# Altium project Electro_plant.PrjPcb
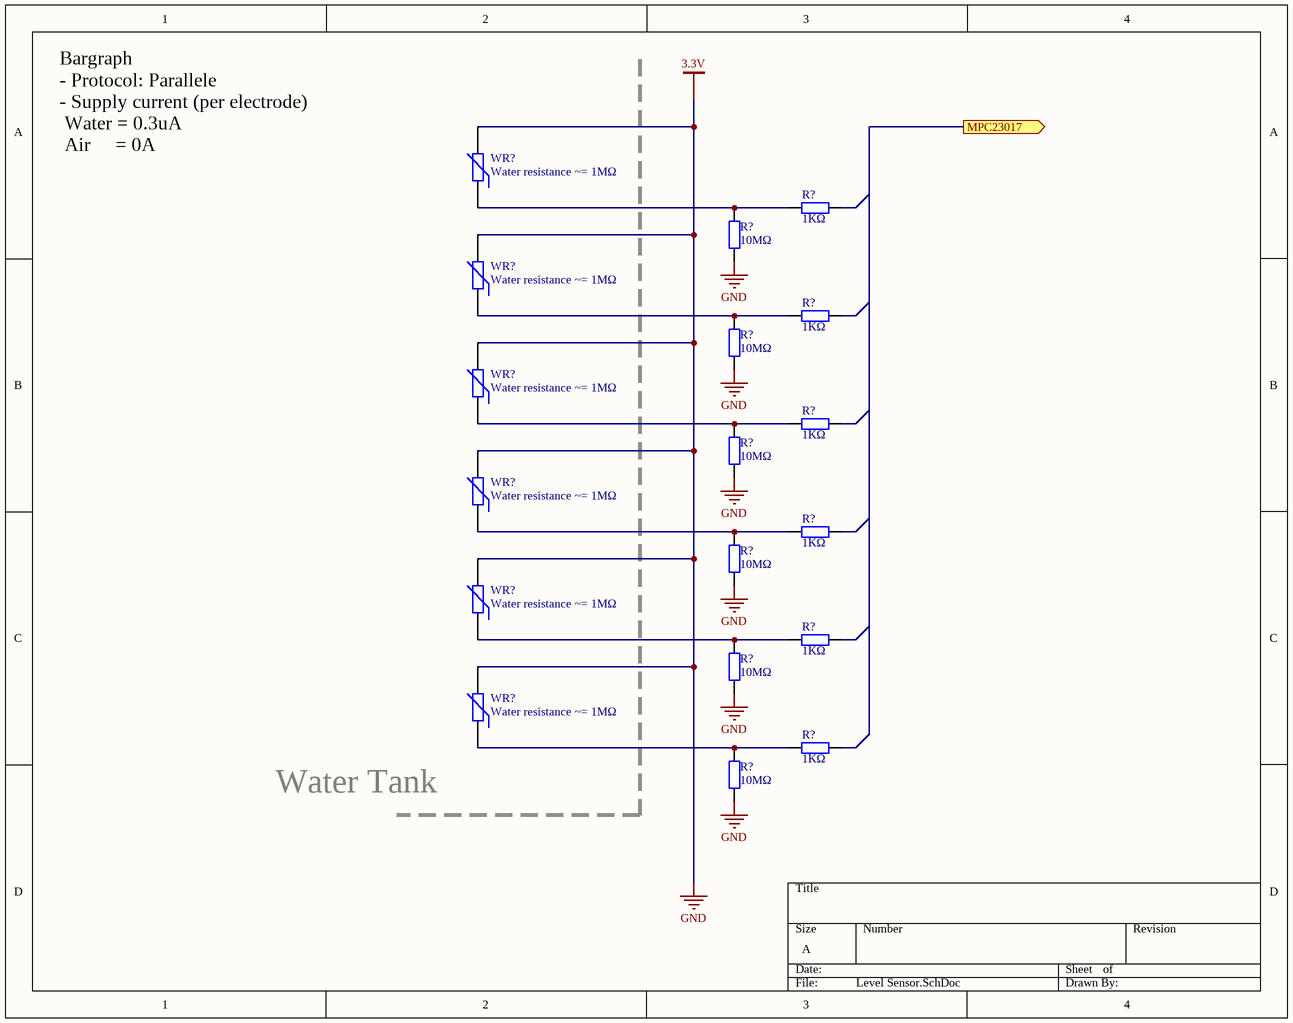
[diagram p0: Level Sensor.SchDoc]
10 sheets, 61 parts. Net scope: flat (ports and power ports of the same name join across sheets).
Sheets:
  Level Sensor.SchDoc
  BarGraph.SchDoc
  LCD.SchDoc
  LumSensor.SchDoc
  MPC23017.SchDoc
  Temperature.SchDoc
  SoilMoisture.SchDoc
  PIC.SchDoc
  LedAlert.SchDoc
  BlueTooth.SchDoc

## Sheet Level Sensor.SchDoc
size A

### Parts
(Parts that share a designator on the sheet are numbered #1, #2 ... from top to bottom, then left to right.)
R?#1  1KΩ  [AXIAL-0.4]
R?#2  10MΩ  [AXIAL-0.4]
R?#3  1KΩ  [AXIAL-0.4]
R?#4  10MΩ  [AXIAL-0.4]
R?#5  1KΩ  [AXIAL-0.4]
R?#6  10MΩ  [AXIAL-0.4]
R?#7  1KΩ  [AXIAL-0.4]
R?#8  10MΩ  [AXIAL-0.4]
R?#9  1KΩ  [AXIAL-0.4]
R?#10  10MΩ  [AXIAL-0.4]
R?#11  1KΩ  [AXIAL-0.4]
R?#12  10MΩ  [AXIAL-0.4]
WR?#1  Water resistance ~= 1MΩ  [6-0805_N]
WR?#2  Water resistance ~= 1MΩ  [6-0805_N]
WR?#3  Water resistance ~= 1MΩ  [6-0805_N]
WR?#4  Water resistance ~= 1MΩ  [6-0805_N]
WR?#5  Water resistance ~= 1MΩ  [6-0805_N]
WR?#6  Water resistance ~= 1MΩ  [6-0805_N]

### Ports
MPC23017 (out)

### Nets
3.3V: R?#2.1 R?#4.1 R?#6.1 R?#8.1 R?#10.1 R?#12.1 WR?#1.2 WR?#2.2 WR?#3.2 WR?#4.2 WR?#5.2 WR?#6.2  [also labelled GND]
NetR?#1_2: R?#1.2 R?#2.2 WR?#1.1
NetR?#3_2: R?#3.2 R?#4.2 WR?#2.1
NetR?#5_2: R?#5.2 R?#6.2 WR?#3.1
NetR?#7_2: R?#7.2 R?#8.2 WR?#4.1
NetR?#9_2: R?#9.2 R?#10.2 WR?#5.1
NetR?#11_2: R?#11.2 R?#12.2 WR?#6.1

Not connected (* = marked no-connect by the designer): R?#1 1; R?#3 1; R?#5 1; R?#7 1; R?#9 1; R?#11 1

### Notes on the sheet
- Bargraph
  - Protocol: Parallele
  - Supply current (per electrode)
  Water = 0.3uA
  Air     = 0A
- Water Tank

### Library data of the parts
R?#1-R?#12 = Res2: Resistor; Value: 1K; Published: 8-Jun-2000; LatestRevisionDate: 17-Jul-2002; LatestRevisionNote: Re-released for DXP Platform.; PackageReference: AXIAL-0.4; Publisher: Altium Limited; PackageDescription: Axial Device, Thru-Hole; 2 Leads; 0.4 in Pin Spacing
WR?#1-WR?#6 = Res Varistor: Varistor (Voltage-Sensitive Resistor); Published: 24-Mar-1999; LatestRevisionDate: 29-May-2009; LatestRevisionNote: IPC-7351 Footprint Added.; PackageVersion: Mar-2003; PackageReference: 6-0805; Publisher: Altium Limited; PackageDescription: Chip Resistor 0805 Case Size; Code_IPC: RESC2012

## Sheet BarGraph.SchDoc
size A
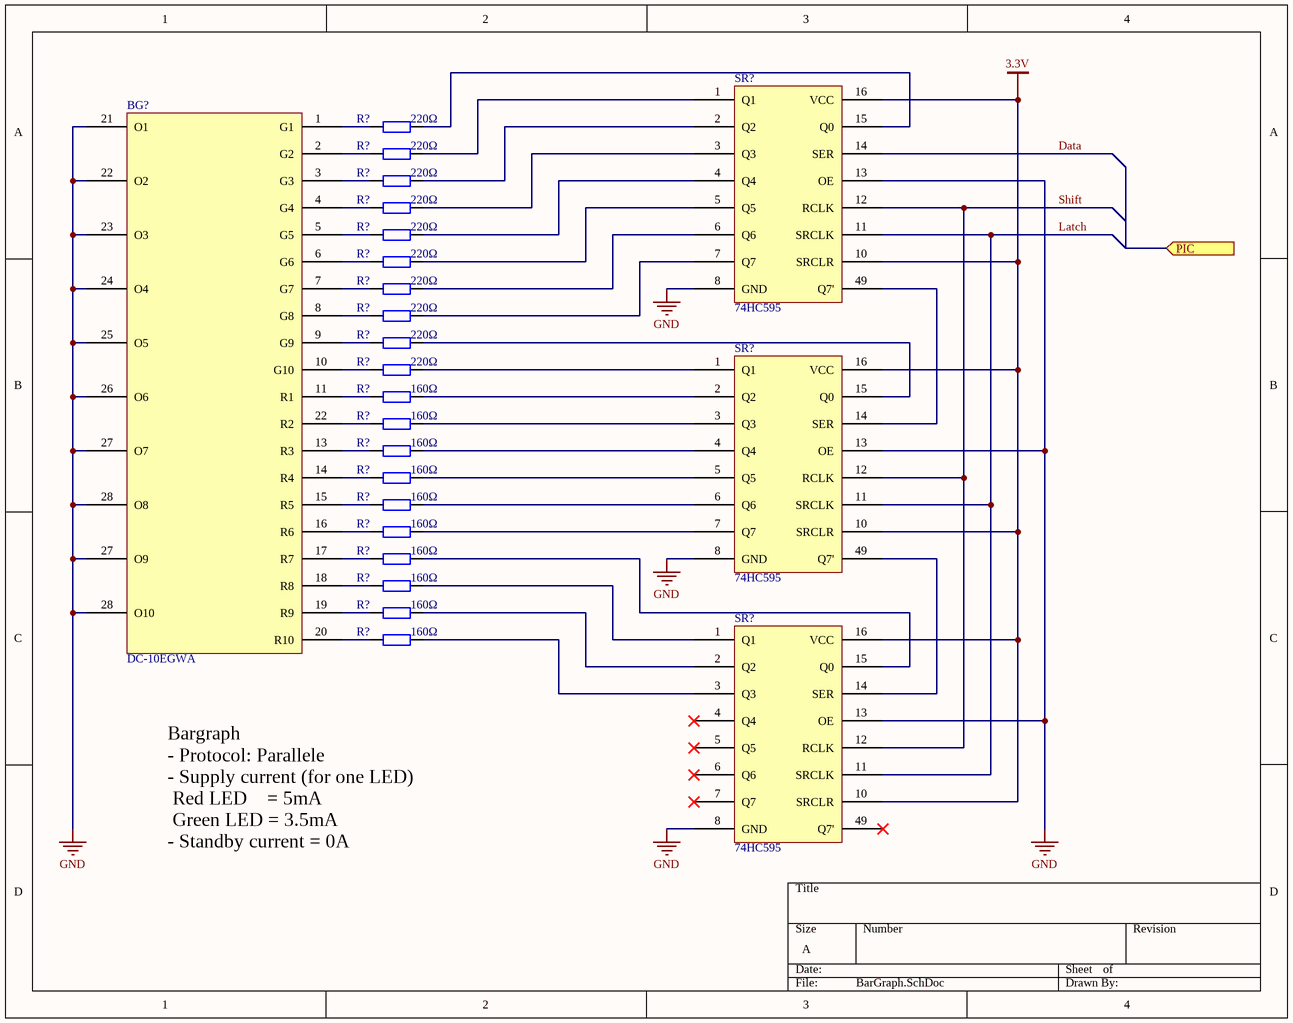
[diagram p1: BarGraph.SchDoc]

### Parts
(Parts that share a designator on the sheet are numbered #1, #2 ... from top to bottom, then left to right.)
BG?  DC-10EGWA
R?#13  220Ω  [AXIAL-0.4]
R?#14  220Ω  [AXIAL-0.4]
R?#15  220Ω  [AXIAL-0.4]
R?#16  220Ω  [AXIAL-0.4]
R?#17  220Ω  [AXIAL-0.4]
R?#18  220Ω  [AXIAL-0.4]
R?#19  220Ω  [AXIAL-0.4]
R?#20  220Ω  [AXIAL-0.4]
R?#21  220Ω  [AXIAL-0.4]
R?#22  220Ω  [AXIAL-0.4]
R?#23  160Ω  [AXIAL-0.4]
R?#24  160Ω  [AXIAL-0.4]
R?#25  160Ω  [AXIAL-0.4]
R?#26  160Ω  [AXIAL-0.4]
R?#27  160Ω  [AXIAL-0.4]
R?#28  160Ω  [AXIAL-0.4]
R?#29  160Ω  [AXIAL-0.4]
R?#30  160Ω  [AXIAL-0.4]
R?#31  160Ω  [AXIAL-0.4]
R?#32  160Ω  [AXIAL-0.4]
SR?#1  74HC595
SR?#2  74HC595
SR?#3  74HC595

### Ports
PIC (in)

### Nets
3.3V: BG?.21(O1) BG?.22(O2) BG?.23(O3) BG?.24(O4) BG?.25(O5) BG?.26(O6) BG?.27(O7) BG?.28(O8) SR?#1.8(GND) SR?#1.10(SRCLR) SR?#1.13(OE) SR?#1.16(VCC) SR?#2.8(GND) SR?#2.10(SRCLR) SR?#2.13(OE) SR?#2.16(VCC) SR?#3.8(GND) SR?#3.10(SRCLR) SR?#3.13(OE) SR?#3.16(VCC)  [also labelled GND]
Data: SR?#1.14(SER)
Latch: SR?#1.11(SRCLK) SR?#2.11(SRCLK) SR?#3.11(SRCLK)
Shift: SR?#1.12(RCLK) SR?#2.12(RCLK) SR?#3.12(RCLK)
NetBG?_1: BG?.1(G1) R?#13.1
NetBG?_2: BG?.2(G2) R?#14.1
NetBG?_3: BG?.3(G3) R?#15.1
NetBG?_4: BG?.4(G4) R?#16.1
NetBG?_5: BG?.5(G5) R?#17.1
NetBG?_6: BG?.6(G6) R?#18.1
NetBG?_7: BG?.7(G7) R?#19.1
NetBG?_8: BG?.8(G8) R?#20.1
NetBG?_9: BG?.9(G9) R?#21.1
NetBG?_10: BG?.10(G10) R?#22.1
NetBG?_11: BG?.11(R1) R?#23.1
NetBG?_13: BG?.13(R3) R?#25.1
NetBG?_14: BG?.14(R4) R?#26.1
NetBG?_15: BG?.15(R5) R?#27.1
NetBG?_16: BG?.16(R6) R?#28.1
NetBG?_17: BG?.17(R7) R?#29.1
NetBG?_18: BG?.18(R8) R?#30.1
NetBG?_19: BG?.19(R9) R?#31.1
NetBG?_20: BG?.20(R10) R?#32.1
NetBG?_22: BG?.22(R2) R?#24.1
NetR?#13_2: R?#13.2 SR?#1.15(Q0)
NetR?#14_2: R?#14.2 SR?#1.1(Q1)
NetR?#15_2: R?#15.2 SR?#1.2(Q2)
NetR?#16_2: R?#16.2 SR?#1.3(Q3)
NetR?#17_2: R?#17.2 SR?#1.4(Q4)
NetR?#18_2: R?#18.2 SR?#1.5(Q5)
NetR?#19_2: R?#19.2 SR?#1.6(Q6)
NetR?#20_2: R?#20.2 SR?#1.7(Q7)
NetR?#21_2: R?#21.2 SR?#2.15(Q0)
NetR?#22_2: R?#22.2 SR?#2.1(Q1)
NetR?#23_2: R?#23.2 SR?#2.2(Q2)
NetR?#24_2: R?#24.2 SR?#2.3(Q3)
NetR?#25_2: R?#25.2 SR?#2.4(Q4)
NetR?#26_2: R?#26.2 SR?#2.5(Q5)
NetR?#27_2: R?#27.2 SR?#2.6(Q6)
NetR?#28_2: R?#28.2 SR?#2.7(Q7)
NetR?#29_2: R?#29.2 SR?#3.15(Q0)
NetR?#30_2: R?#30.2 SR?#3.1(Q1)
NetR?#31_2: R?#31.2 SR?#3.2(Q2)
NetR?#32_2: R?#32.2 SR?#3.3(Q3)
NetSR?#1_49: SR?#1.49(Q7') SR?#2.14(SER)
NetSR?#2_49: SR?#2.49(Q7') SR?#3.14(SER)

Not connected (* = marked no-connect by the designer): SR?#3 4(Q4)* 5(Q5)* 6(Q6)* 7(Q7)* 49(Q7')*

### Notes on the sheet
- Bargraph
  - Protocol: Parallele
  - Supply current (for one LED)
  Red LED    = 5mA
  Green LED = 3.5mA
  - Standby current = 0A

### Library data of the parts
BG? SR?#1-SR?#3 = Component_1
R?#13-R?#32 = Res2: Resistor; Value: 1K; Published: 8-Jun-2000; LatestRevisionDate: 17-Jul-2002; LatestRevisionNote: Re-released for DXP Platform.; PackageReference: AXIAL-0.4; Publisher: Altium Limited; PackageDescription: Axial Device, Thru-Hole; 2 Leads; 0.4 in Pin Spacing

## Sheet LCD.SchDoc
size A
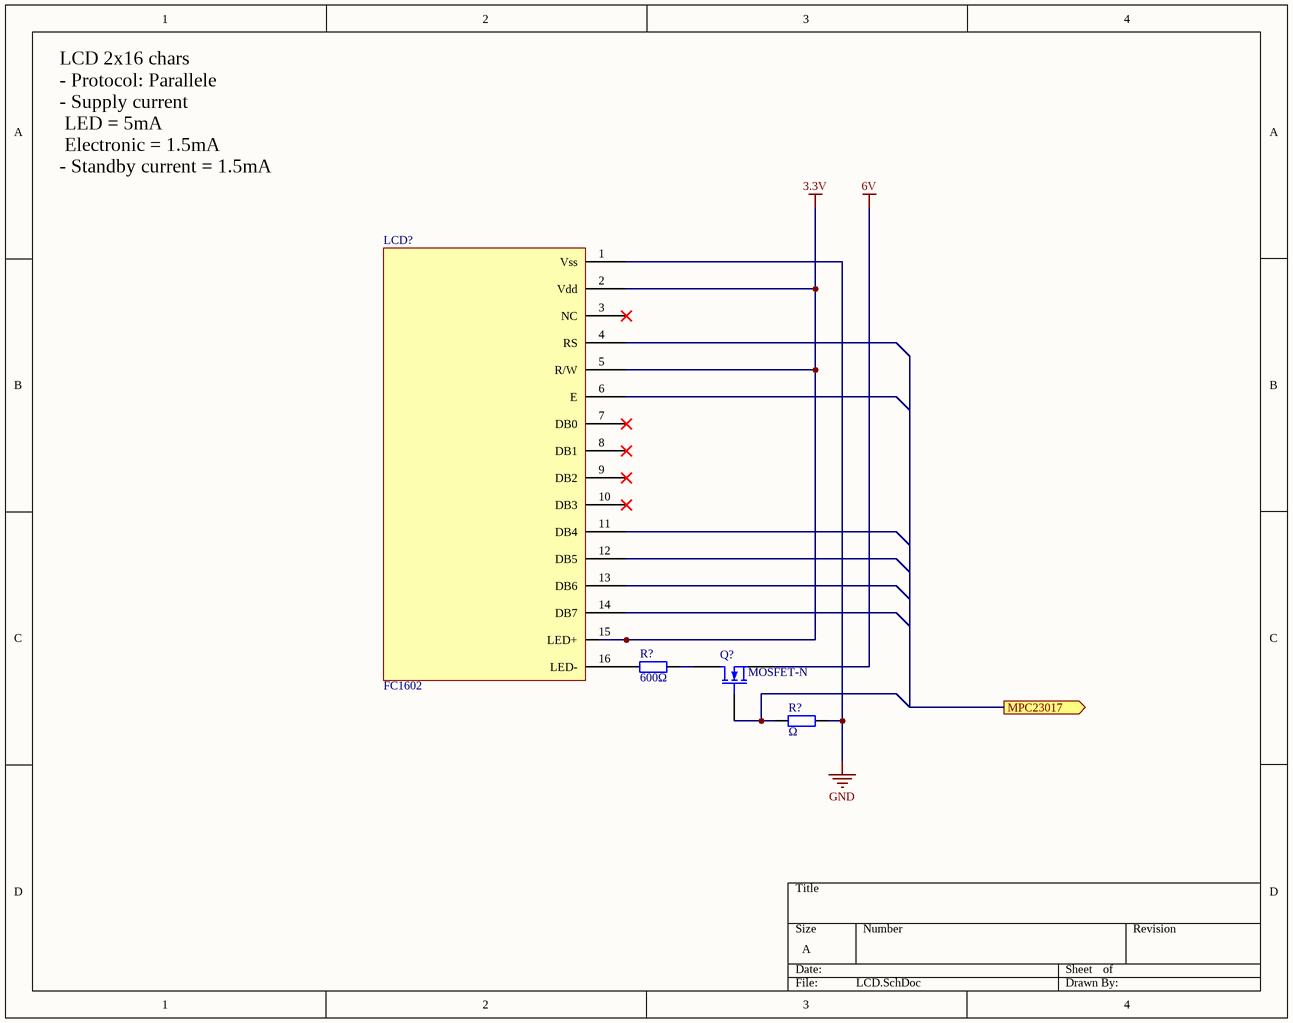
[diagram p2: LCD.SchDoc]

### Parts
(Parts that share a designator on the sheet are numbered #1, #2 ... from top to bottom, then left to right.)
LCD?  FC1602
Q?#1  MOSFET-N  [E3]
R?#33  600Ω  [AXIAL-0.4]
R?#34  Ω  [AXIAL-0.4]

### Ports
MPC23017 (out)

### Nets
3.3V: LCD?.1(Vss) LCD?.2(Vdd) LCD?.5(R/W) LCD?.15(LED+) R?#34.1  [also labelled GND]
6V: Q?#1.3(S)
NetLCD?_16: LCD?.16(LED-) R?#33.2
NetQ?#1_1: Q?#1.1(D) R?#33.1
NetQ?#1_2: Q?#1.2(G) R?#34.2

Not connected (* = marked no-connect by the designer): LCD? 3(NC)* 4(RS) 6(E) 7(DB0)* 8(DB1)* 9(DB2)* 10(DB3)* 11(DB4) 12(DB5) 13(DB6) 14(DB7)

### Notes on the sheet
- LCD 2x16 chars
  - Protocol: Parallele
  - Supply current
  LED	= 5mA
  Electronic	= 1.5mA
  - Standby current = 1.5mA

### Library data of the parts
LCD? = Component_1
Q?#1 = MOSFET-N: N-Channel MOSFET; Published: 8-Jun-2000; LatestRevisionDate: 17-Jul-2002; LatestRevisionNote: Re-released for DXP Platform.; PackageVersion: 1995/1996; PackageReference: E3; Publisher: Altium Limited; PackageDescription: TO, Flat Index; 3 In-Line, Axial Leads; Body Dia. 4.6mm; Lead Dia. 0.5 mm (max)
R?#33 R?#34 = Res2: Resistor; Value: 1K; Published: 8-Jun-2000; LatestRevisionDate: 17-Jul-2002; LatestRevisionNote: Re-released for DXP Platform.; PackageReference: AXIAL-0.4; Publisher: Altium Limited; PackageDescription: Axial Device, Thru-Hole; 2 Leads; 0.4 in Pin Spacing

## Sheet LumSensor.SchDoc
size A
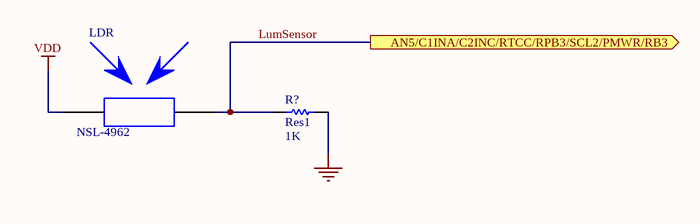
[diagram p3: LumSensor.SchDoc]

### Parts
(Parts that share a designator on the sheet are numbered #1, #2 ... from top to bottom, then left to right.)
LDR  NSL-4962
R?#35  Res1  value 1K  [AXIAL-0.3]

### Ports
AN5/C1INA/C2INC/RTCC/RPB3/SCL2/PMWR/RB3 (out)

### Nets
GND: R?#35.2  [project net 3.3V]
VDD: LDR.1
LumSensor: LDR.2 R?#35.1 ; port AN5/C1INA/C2INC/RTCC/RPB3/SCL2/PMWR/RB3

### Library data of the parts
R?#35 = Res1: Resistor; Published: 8-Jun-2000; LatestRevisionDate: 17-Jul-2002; LatestRevisionNote: Re-released for DXP Platform.; PackageReference: AXIAL-0.3; Publisher: Altium Limited; PackageDescription: Axial Device, Thru-Hole; 2 Leads; 0.3 in Pin Spacing

## Sheet MPC23017.SchDoc
size A
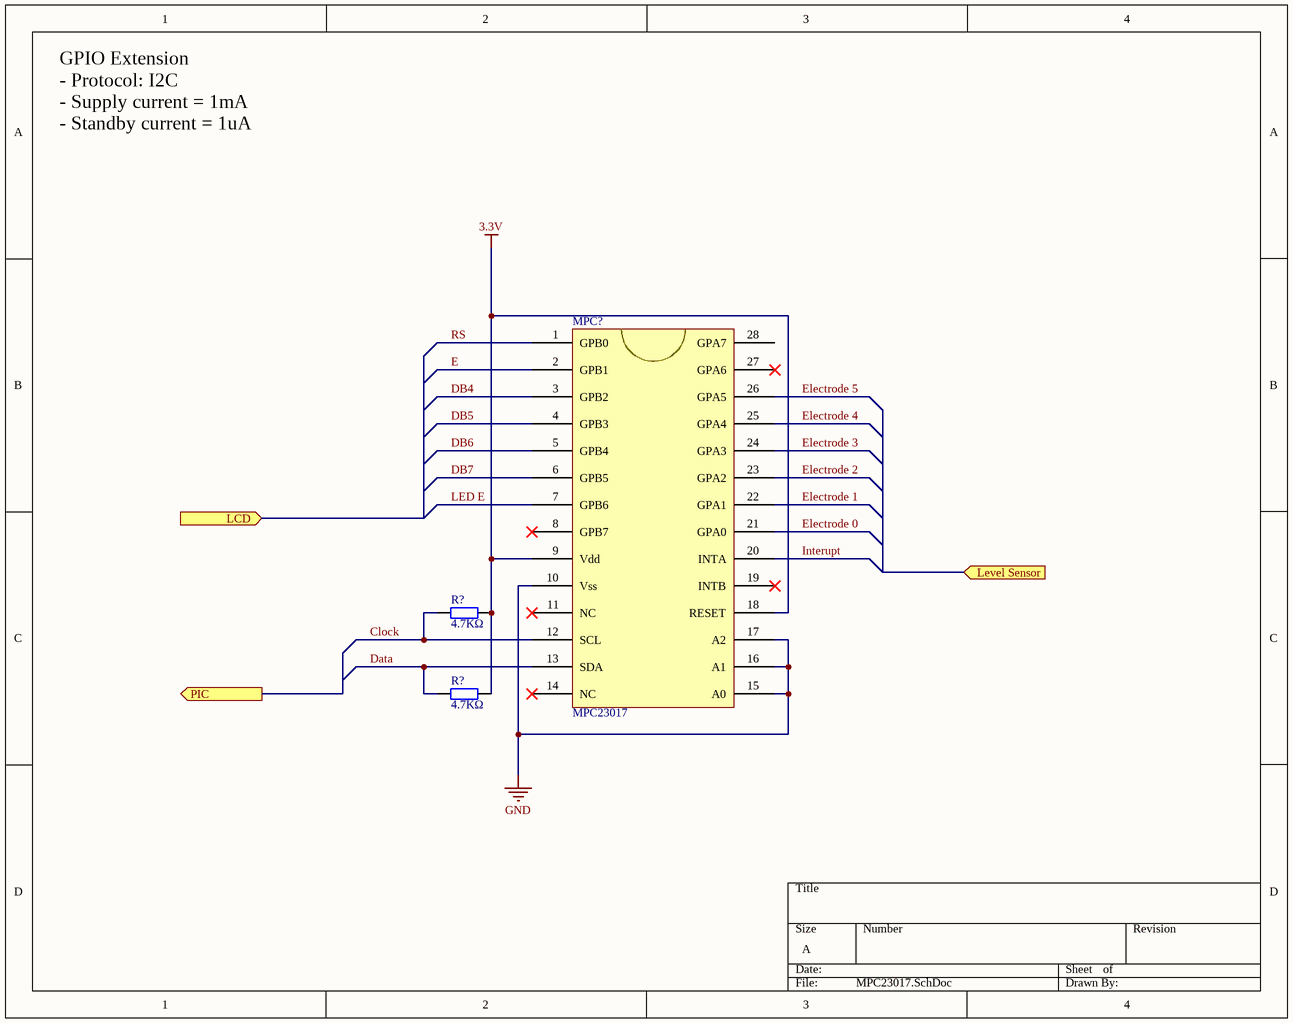
[diagram p4: MPC23017.SchDoc]

### Parts
(Parts that share a designator on the sheet are numbered #1, #2 ... from top to bottom, then left to right.)
MPC?  MPC23017
R?#36  4.7KΩ  [AXIAL-0.4]
R?#37  4.7KΩ  [AXIAL-0.4]

### Ports
LCD (in), Level Sensor (in), PIC (out)

### Nets
3.3V: MPC?.9(Vdd) MPC?.10(Vss) MPC?.15(A0) MPC?.16(A1) MPC?.17(A2) MPC?.18(RESET) R?#36.1 R?#37.1  [also labelled GND]
Clock: MPC?.12(SCL) R?#36.2
Data: MPC?.13(SDA) R?#37.2
DB4: MPC?.3(GPB2)
DB5: MPC?.4(GPB3)
DB6: MPC?.5(GPB4)
DB7: MPC?.6(GPB5)
E: MPC?.2(GPB1)
Electrode 0: MPC?.21(GPA0)
Electrode 1: MPC?.22(GPA1)
Electrode 2: MPC?.23(GPA2)
Electrode 3: MPC?.24(GPA3)
Electrode 4: MPC?.25(GPA4)
Electrode 5: MPC?.26(GPA5)
Interupt: MPC?.20(INTA)
LED E: MPC?.7(GPB6)
RS: MPC?.1(GPB0)

Not connected (* = marked no-connect by the designer): MPC? 8(GPB7)* 11(NC)* 14(NC)* 19(INTB)* 27(GPA6)* 28(GPA7)

### Notes on the sheet
- GPIO Extension
  - Protocol: I2C
  - Supply current = 1mA
  - Standby current = 1uA

### Library data of the parts
MPC? = Component_1
R?#36 R?#37 = Res2: Resistor; Value: 1K; Published: 8-Jun-2000; LatestRevisionDate: 17-Jul-2002; LatestRevisionNote: Re-released for DXP Platform.; PackageReference: AXIAL-0.4; Publisher: Altium Limited; PackageDescription: Axial Device, Thru-Hole; 2 Leads; 0.4 in Pin Spacing

## Sheet Temperature.SchDoc
size A

## Sheet SoilMoisture.SchDoc
size A

## Sheet PIC.SchDoc
size A

## Sheet LedAlert.SchDoc
size A
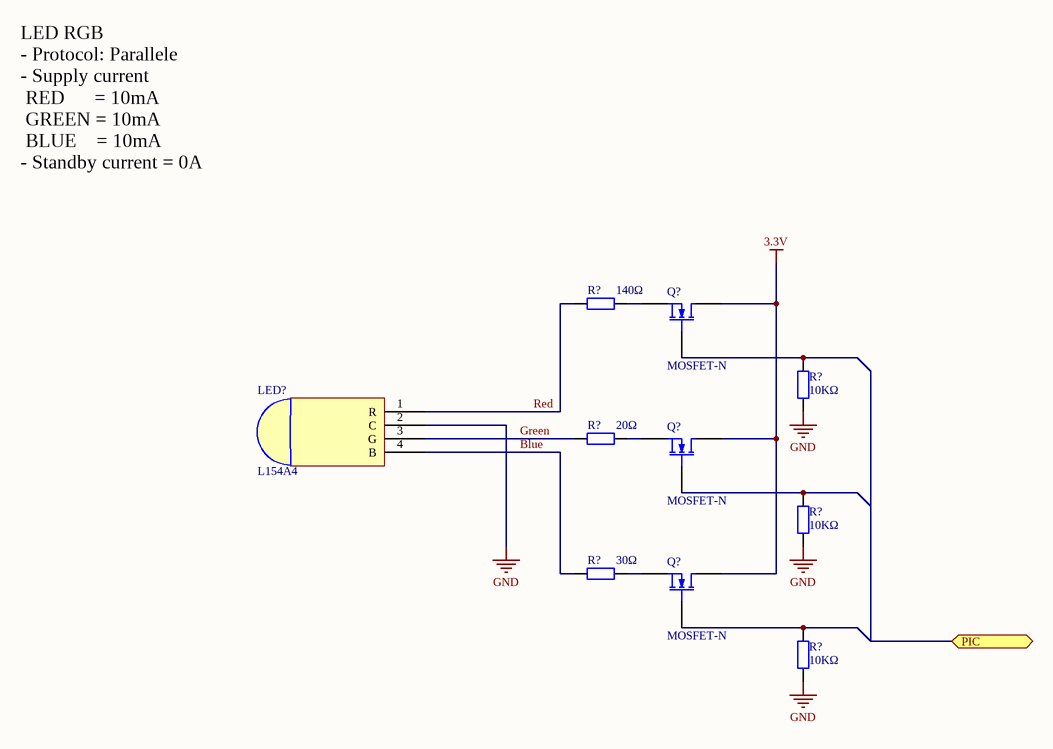
[diagram p5: LedAlert.SchDoc]

### Parts
(Parts that share a designator on the sheet are numbered #1, #2 ... from top to bottom, then left to right.)
LED?  L154A4
Q?#2  MOSFET-N  [E3]
Q?#3  MOSFET-N  [E3]
Q?#4  MOSFET-N  [E3]
R?#38  140Ω  [AXIAL-0.4]
R?#39  10KΩ  [AXIAL-0.4]
R?#40  20Ω  [AXIAL-0.4]
R?#41  10KΩ  [AXIAL-0.4]
R?#42  30Ω  [AXIAL-0.4]
R?#43  10KΩ  [AXIAL-0.4]

### Ports
PIC

### Nets
3.3V: LED?.2(C) Q?#2.1(D) Q?#3.1(D) Q?#4.1(D) R?#39.2 R?#41.2 R?#43.2  [also labelled GND]
Blue: LED?.4(B) R?#42.2
Green: LED?.3(G) R?#40.2
Red: LED?.1(R) R?#38.2
NetQ?#2_2: Q?#2.2(G) R?#39.1
NetQ?#2_3: Q?#2.3(S) R?#38.1
NetQ?#3_2: Q?#3.2(G) R?#41.1
NetQ?#3_3: Q?#3.3(S) R?#40.1
NetQ?#4_2: Q?#4.2(G) R?#43.1
NetQ?#4_3: Q?#4.3(S) R?#42.1

### Notes on the sheet
- LED RGB
  - Protocol: Parallele
  - Supply current
  RED      = 10mA
  GREEN = 10mA
  BLUE    = 10mA
  - Standby current = 0A

### Library data of the parts
LED? = Component_1
Q?#2-Q?#4 = MOSFET-N: N-Channel MOSFET; Published: 8-Jun-2000; LatestRevisionDate: 17-Jul-2002; LatestRevisionNote: Re-released for DXP Platform.; PackageVersion: 1995/1996; PackageReference: E3; Publisher: Altium Limited; PackageDescription: TO, Flat Index; 3 In-Line, Axial Leads; Body Dia. 4.6mm; Lead Dia. 0.5 mm (max)
R?#38-R?#43 = Res2: Resistor; Value: 1K; Published: 8-Jun-2000; LatestRevisionDate: 17-Jul-2002; LatestRevisionNote: Re-released for DXP Platform.; PackageReference: AXIAL-0.4; Publisher: Altium Limited; PackageDescription: Axial Device, Thru-Hole; 2 Leads; 0.4 in Pin Spacing

## Sheet BlueTooth.SchDoc
size A

## Nets that join several sheets
3.3V: Level Sensor (12 pins), BarGraph (20 pins), LCD (5 pins), LumSensor (R?#35.2), MPC23017 (8 pins), LedAlert (7 pins)